# Altium schematic sheet Power.SchDoc
size A4
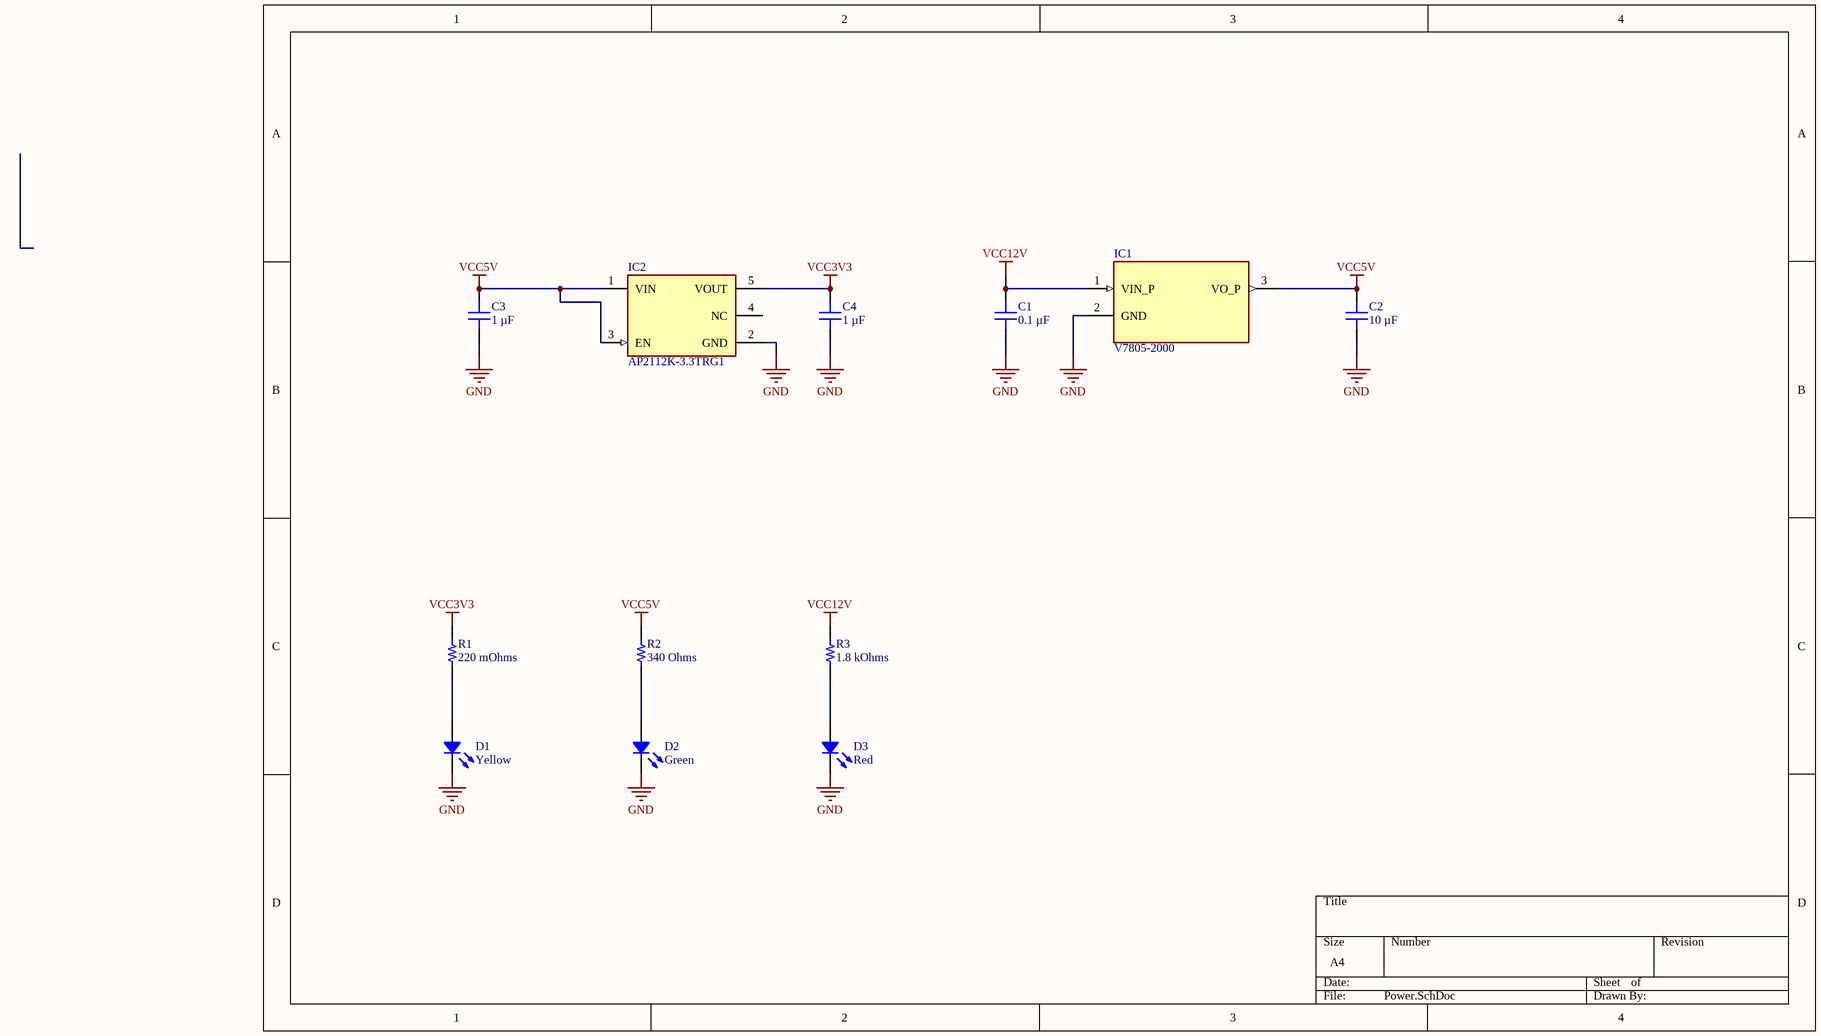
[diagram p0: Power.SchDoc]

## Parts
C1  0.1 µF  [CAP 0201_0603]
C2  10 µF  [CAP 0402_1005]
C3  1 µF  [CAP 0201_0603]
C4  1 µF  [CAP 0201_0603]
D1  Yellow  [LED 1206_3216 YELLOW]
D2  Green  [LED 0805_2012 GREEN]
D3  Red  [LED 1206_3216 RED]
IC1  V7805-2000  [CONV_V7805-2000]
IC2  AP2112K-3.3TRG1  [FP-SOT25-IPC_A]
R1  220 mOhms  [RES 0201_0603]
R2  340 Ohms  [RES 0201_0603]
R3  1.8 kOhms  [RES 0201_0603]

## Nets
GND: C1.1 C2.1 C3.1 C4.1 D1.2 D2.2 D3.2 IC1.2(GND) IC2.2(GND)
VCC3V3: C4.2 IC2.5(VOUT) R1.2
VCC5V: C2.2 C3.2 IC1.3(VO_P) IC2.1(VIN) IC2.3(EN) R2.2
VCC12V: C1.2 IC1.1(VIN_P) R3.2
NetD1_1: D1.1 R1.1
NetD2_1: D2.1 R2.1
NetD3_1: D3.1 R3.1

Not connected (* = marked no-connect by the designer): IC2 4(NC)

## Library data of the parts
C1 = EMK063BJ104MP-F: CAP CER 0.1UF 16V X5R 0201; manufacturer: Taiyo Yuden; Tolerance: ±20%; Part Number: EMK063BJ104MP-F; Value: 0.1 µF; Applications: SMPS Filtering; Capacitance: 0.1 µF; componentlink1description: Datasheet; componentlink1url: https://ds.yuden.co.jp/TYCOMPAS/ut/detail?pn=EMK063BJ104MP-F &u=M; componentlink2description: DigiKey Link; componentlink2url: https://www.digikey.com/en/products/detail/taiyo-yuden/EMK063BJ104MP-F/7403527; Device Package: 0201 (0603 Metric); lastupdated: 2024-01-11 8:00:55 PM; Lifecycle Status: Active; Minimum Order: 1; Mounting Type: Surface Mount, MLCC; Operating Temperature: -55°C ~ 85°C; Package / Case: 0201 (0603 Metric); packaging: CutTape; partid: 79; Part Status: Active; price: 0.01; series: M; Size / Dimension: 0.024" L x 0.012" W (0.60mm x 0.30mm); Supplier 1: DigiKey; Supplier Part Number 1: 587-6302-1-ND; Temperature Coefficient: X5R; Thickness (Max): 0.015" (0.39mm); Voltage - Rated: 16V
C2 = CL05A106MP8NUB8: CAP CER 10UF 10V X5R 0402; manufacturer: Samsung Electro-Mechanics; Tolerance: ±20%; Part Number: CL05A106MP8NUB8; Value: 10 µF; Applications: Acoustic Noise Reduction; Capacitance: 10 µF; componentlink1description: Datasheet; componentlink1url: http://www.samsungsem.com/kr/support/product-search/mlcc/CL05A106MP8NUB8.jsp; componentlink2description: DigiKey Link; componentlink2url: https://www.digikey.com/en/products/detail/samsung-electro-mechanics/CL05A106MP8NUB8/5961314; Device Package: 0402 (1005 Metric); lastupdated: 2024-01-11 8:04:27 PM; Lifecycle Status: Active; Minimum Order: 1; Mounting Type: Surface Mount, MLCC; Operating Temperature: -55°C ~ 85°C; Package / Case: 0402 (1005 Metric); packaging: TapeAndReel; partid: 1758; Part Status: Active; price: 0.06; series: CL; Size / Dimension: 0.039" L x 0.020" W (1.00mm x 0.50mm); Supplier 1: DigiKey; Supplier Part Number 1: 1276-6830-1-ND; Temperature Coefficient: X5R; Thickness (Max): 0.035" (0.90mm); Voltage - Rated: 10V
C3 C4 = CL03A105MQ3CSNC: CAP CER 1UF 6.3V X5R 0201; manufacturer: Samsung Electro-Mechanics; Tolerance: ±20%; Part Number: CL03A105MQ3CSNC; Value: 1 µF; Applications: General Purpose; Capacitance: 1 µF; componentlink1description: Datasheet; componentlink1url: http://www.samsungsem.com/kr/support/product-search/mlcc/CL03A105MQ3CSNC.jsp; componentlink2description: DigiKey Link; componentlink2url: https://www.digikey.com/en/products/detail/samsung-electro-mechanics/CL03A105MQ3CSNC/3886983; Device Package: 0201 (0603 Metric); lastupdated: 2024-01-11 8:00:55 PM; Lifecycle Status: Active; Minimum Order: 1; Mounting Type: Surface Mount, MLCC; Operating Temperature: -55°C ~ 85°C; Package / Case: 0201 (0603 Metric); packaging: TapeAndReel; partid: 93; Part Status: Active; price: 0.01; series: CL; Size / Dimension: 0.024" L x 0.012" W (0.60mm x 0.30mm); Supplier 1: DigiKey; Supplier Part Number 1: 1276-1325-1-ND; Temperature Coefficient: X5R; Thickness (Max): 0.013" (0.33mm); Voltage - Rated: 6.3V
D1 = 25-21UYC/S530-A2/TR8: LED YELLOW CLEAR 2SMD; Manufacturer: Everlight Electronics Co Ltd; Configuration: Standard; Current - Test: 20mA; Lens Color: Colorless; Lens Size: 1.10mm Dia; Lens Style: Round with Domed Top; Millicandela Rating: 45mcd; Viewing Angle: 60°; Voltage - Forward (Vf) (Typ): 2V; Wavelength - Dominant: 589nm; Wavelength - Peak: 591nm; Part Number: 25-21UYC/S530-A2/TR8; Color: Yellow; ComponentLink1Description: Datasheet; ComponentLink1URL: //media.digikey.com/pdf/Data%20Sheets/Everlight%20PDFs/25-21UYC-S530-A2-TR8_V6_11-12-18.pdf; ComponentLink2Description: DigiKey Link; ComponentLink2URL: https://www.digikey.com/en/products/detail/everlight-electronics-co-ltd/25-21UYC-S530-A2-TR8/8535289; Device Package: 1206 (3216 Metric); Height (Max): 1.20mm; LastUpdated: 2023-08-19 8:22:38 PM; Lens Transparency: Clear; Lifecycle Status: Active; Minimum Order: 1; Mounting Type: Surface Mount; Package / Case: 1206 (3216 Metric); Packaging: TapeAndReel; PartId: 2; Part Status: Active; Price: 0.08; Series: -; Size / Dimension: 3.20mm L x 1.60mm W; Supplier 1: DigiKey; Supplier Part Number 1: 1080-1595-1-ND; Supplier Device Package: 2-SMD; Value: Yellow
D2 = QTLP630C4TR: LED GREEN CLEAR 0805 SMD; Manufacturer: Everlight Electronics Co Ltd; Configuration: Standard; Current - Test: 20mA; Lens Color: Colorless; Lens Size: 1.40mm x 1.25mm; Lens Style: Rectangle with Flat Top; Millicandela Rating: 10mcd; Viewing Angle: 140°; Voltage - Forward (Vf) (Typ): 2.1V; Wavelength - Dominant: 570nm; Wavelength - Peak: 565nm; Part Number: QTLP630C4TR; Color: Green; ComponentLink1Description: Datasheet; ComponentLink1URL: //media.digikey.com/PDF/Data%20Sheets/Everlight%20PDFs/QTLP630-2.pdf; ComponentLink2Description: DigiKey Link; ComponentLink2URL: https://www.digikey.com/en/products/detail/everlight-electronics-co-ltd/QTLP630C4TR/2675902; Device Package: 0805 (2012 Metric); Height (Max): 1.20mm; LastUpdated: 2023-08-19 8:21:40 PM; Lens Transparency: Clear; Lifecycle Status: Active; Minimum Order: 1; Mounting Type: Surface Mount; Package / Case: 0805 (2012 Metric); Packaging: TapeAndReel; PartId: 240; Part Status: Active; Price: 0.05; Series: -; Size / Dimension: 2.00mm L x 1.25mm W; Supplier 1: DigiKey; Supplier Part Number 1: 1080-1411-1-ND; Supplier Device Package: 0805; Value: Green
D3 = XZMDK55W-A2RT: LED RED CLEAR 2SMD; Manufacturer: SunLED; Configuration: Standard; Current - Test: 20mA; Lens Color: Colorless; Lens Size: 1.10mm Dia; Lens Style: Round with Flat Top; Millicandela Rating: 228mcd; Viewing Angle: 70°; Voltage - Forward (Vf) (Typ): 1.95V; Wavelength - Dominant: 630nm; Wavelength - Peak: 645nm; Part Number: XZMDK55W-A2RT; Color: Red; ComponentLink1Description: Datasheet; ComponentLink1URL: https://www.sunledusa.com/products/spec/XZMDK55W-A2RT.pdf; ComponentLink2Description: DigiKey Link; ComponentLink2URL: https://www.digikey.com/en/products/detail/sunled/XZMDK55W-A2RT/5775264; Device Package: 1206 (3216 Metric); Height (Max): 1.20mm; LastUpdated: 2023-08-19 8:21:50 PM; Lens Transparency: Clear; Lifecycle Status: Active; Minimum Order: 1; Mounting Type: Surface Mount; Package / Case: 1206 (3216 Metric); Packaging: TapeAndReel; PartId: 183; Part Status: Active; Price: 0.06; Series: -; Size / Dimension: 3.20mm L x 1.60mm W; Supplier 1: DigiKey; Supplier Part Number 1: 1497-1289-1-ND; Supplier Device Package: 2-SMD; Value: Red
IC1 = V7805-2000: 2 A Output Current, 4.75~18 Vdc Input, 3 Pin SIP, Non-Isolated, Dc-Dc Converter; MF: CUI Inc.; DigiKey-Purchase-URL: https://snapeda.com/shop?store=DigiKey&id=2773183; Package: SIP-3 CUI; Value: *; MP: V7805-2000; CUI_purchase_URL: https://www.cui.com/product/dc-dc-converters/non-isolated/v78-2000-series?utm_source=snapeda.com&utm_medium=referral&utm_campaign=snapedaBOM; SnapEDA_Link: https://www.snapeda.com/parts/V7805-2000/CUI/view-part/2773183/?ref=snap; Digi-Key_Part_Number: 102-2188-ND
IC2 = CMP-12756-000035-1: IC REG LINEAR 3.3V 600MA SOT25; Number of Regulators: 1; Output Type: Fixed; Polarity: Positive; Min Input Voltage: 2.5V; Max Input Voltage: 6V; Accuracy: 1.5%; Quiescent Current: 55uA; Dropout Voltage: 250mV; Min Operating Temperature: -40°C; Length: 3.1mm; Output Current: 600mA; Max Operating Temperature: 85°C; Package Quantity: 1; Output Voltage: 3.3V; Width: 1.7mm; Number of Outputs: 1; Packaging: Tape and Reel; Height: 1.3mm; Lead Free: Lead Free; Max Output Current: 600mA; Case/Package: SOT-23-5; Mount: Surface Mount; Number of Pins: 5
R1 = UCR006YVPFLR220: RES 0.22 OHM 1% 1/10W 0201; Manufacturer: Rohm Semiconductor; Power (Watts): 0.1W, 1/10W; Temperature Coefficient: 0/ +300ppm/°C; Part Number: UCR006YVPFLR220; Value: 220 mOhms; ComponentLink1Description: Datasheet; ComponentLink1URL: https://www.rohm.com/datasheet/UCR10EVHJS/ucr-e; ComponentLink2Description: DigiKey Link; ComponentLink2URL: https://www.digikey.com/en/products/detail/rohm-semiconductor/UCR006YVPFLR220/5247873; Composition: Thick Film; Device Package: 0201 (0603 Metric); Features: Current Sense; Height - Seated (Max): 0.011" (0.28mm); LastUpdated: 2023-08-19 7:17:26 PM; Lifecycle Status: Active; Minimum Order: 1; Number of Terminations: 2; Operating Temperature: -55°C ~ 155°C; Package / Case: 0201 (0603 Metric); Packaging: TapeAndReel; PartId: 108; Part Status: Active; Price: 0.12; Resistance: 220 mOhms; Series: UCR; Size / Dimension: 0.024" L x 0.013" W (0.60mm x 0.33mm); Supplier 1: DigiKey; Supplier Part Number 1: RHM1702-1-ND; Supplier Device Package: 0201; Tolerance: ±1%
R2 = AC0201FR-07340RL: RES SMD 340 OHM 1% 1/20W 0201; Manufacturer: Yageo; Power (Watts): 0.05W, 1/20W; Temperature Coefficient: ±200ppm/°C; Part Number: AC0201FR-07340RL; Value: 340 Ohms; ComponentLink1Description: Datasheet; ComponentLink1URL: https://www.yageo.com/upload/media/product/productsearch/datasheet/rchip/PYu-AC_51_RoHS_L_7.pdf; ComponentLink2Description: DigiKey Link; ComponentLink2URL: https://www.digikey.com/en/products/detail/yageo/AC0201FR-07340RL/5894560; Composition: Thick Film; Device Package: 0201 (0603 Metric); Features: Automotive AEC-Q200, Moisture Resistant; Height - Seated (Max): 0.010" (0.26mm); LastUpdated: 2023-08-19 7:17:26 PM; Lifecycle Status: Active; Minimum Order: 1; Number of Terminations: 2; Operating Temperature: -55°C ~ 155°C; Package / Case: 0201 (0603 Metric); Packaging: TapeAndReel; PartId: 145; Part Status: Active; Price: 0.01; Ratings: AEC-Q200; Resistance: 340 Ohms; Series: AC; Size / Dimension: 0.024" L x 0.012" W (0.60mm x 0.30mm); Supplier 1: DigiKey; Supplier Part Number 1: YAG5199CT-ND; Supplier Device Package: 0201; Tolerance: ±1%
R3 = CRCW02011K80JNED: RES SMD 1.8K OHM 5% 1/20W 0201; Manufacturer: Vishay Dale; Power (Watts): 0.05W, 1/20W; Temperature Coefficient: ±200ppm/°C; Part Number: CRCW02011K80JNED; Value: 1.8 kOhms; ComponentLink1Description: Datasheet; ComponentLink1URL: http://www.vishay.com/docs/20052/crcw0201e3.pdf; ComponentLink2Description: DigiKey Link; ComponentLink2URL: https://www.digikey.com/en/products/detail/vishay-dale/CRCW02011K80JNED/1199542; Composition: Thick Film; Device Package: 0201 (0603 Metric); Height - Seated (Max): 0.010" (0.26mm); LastUpdated: 2023-08-19 7:17:24 PM; Lifecycle Status: Active; Minimum Order: 1; Number of Terminations: 2; Operating Temperature: -55°C ~ 155°C; Package / Case: 0201 (0603 Metric); Packaging: CutTape; PartId: 479; Part Status: Active; Price: 0.01; Resistance: 1.8 kOhms; Series: CRCW; Size / Dimension: 0.024" L x 0.012" W (0.60mm x 0.30mm); Supplier 1: DigiKey; Supplier Part Number 1: 541-CRCW02011K80JNEDCT-ND; Supplier Device Package: 0201; Tolerance: ±5%